# Altium schematic sheet Sensors.SchDoc: Sensors Signal Conditioners
size A3; Author: Eladio Delgado Mingorance; CompanyName: bq - Mundo Reader; Organization: bq - Mundo Reader; Revision: 1.4; SheetNumber: 3; SheetTotal: 10
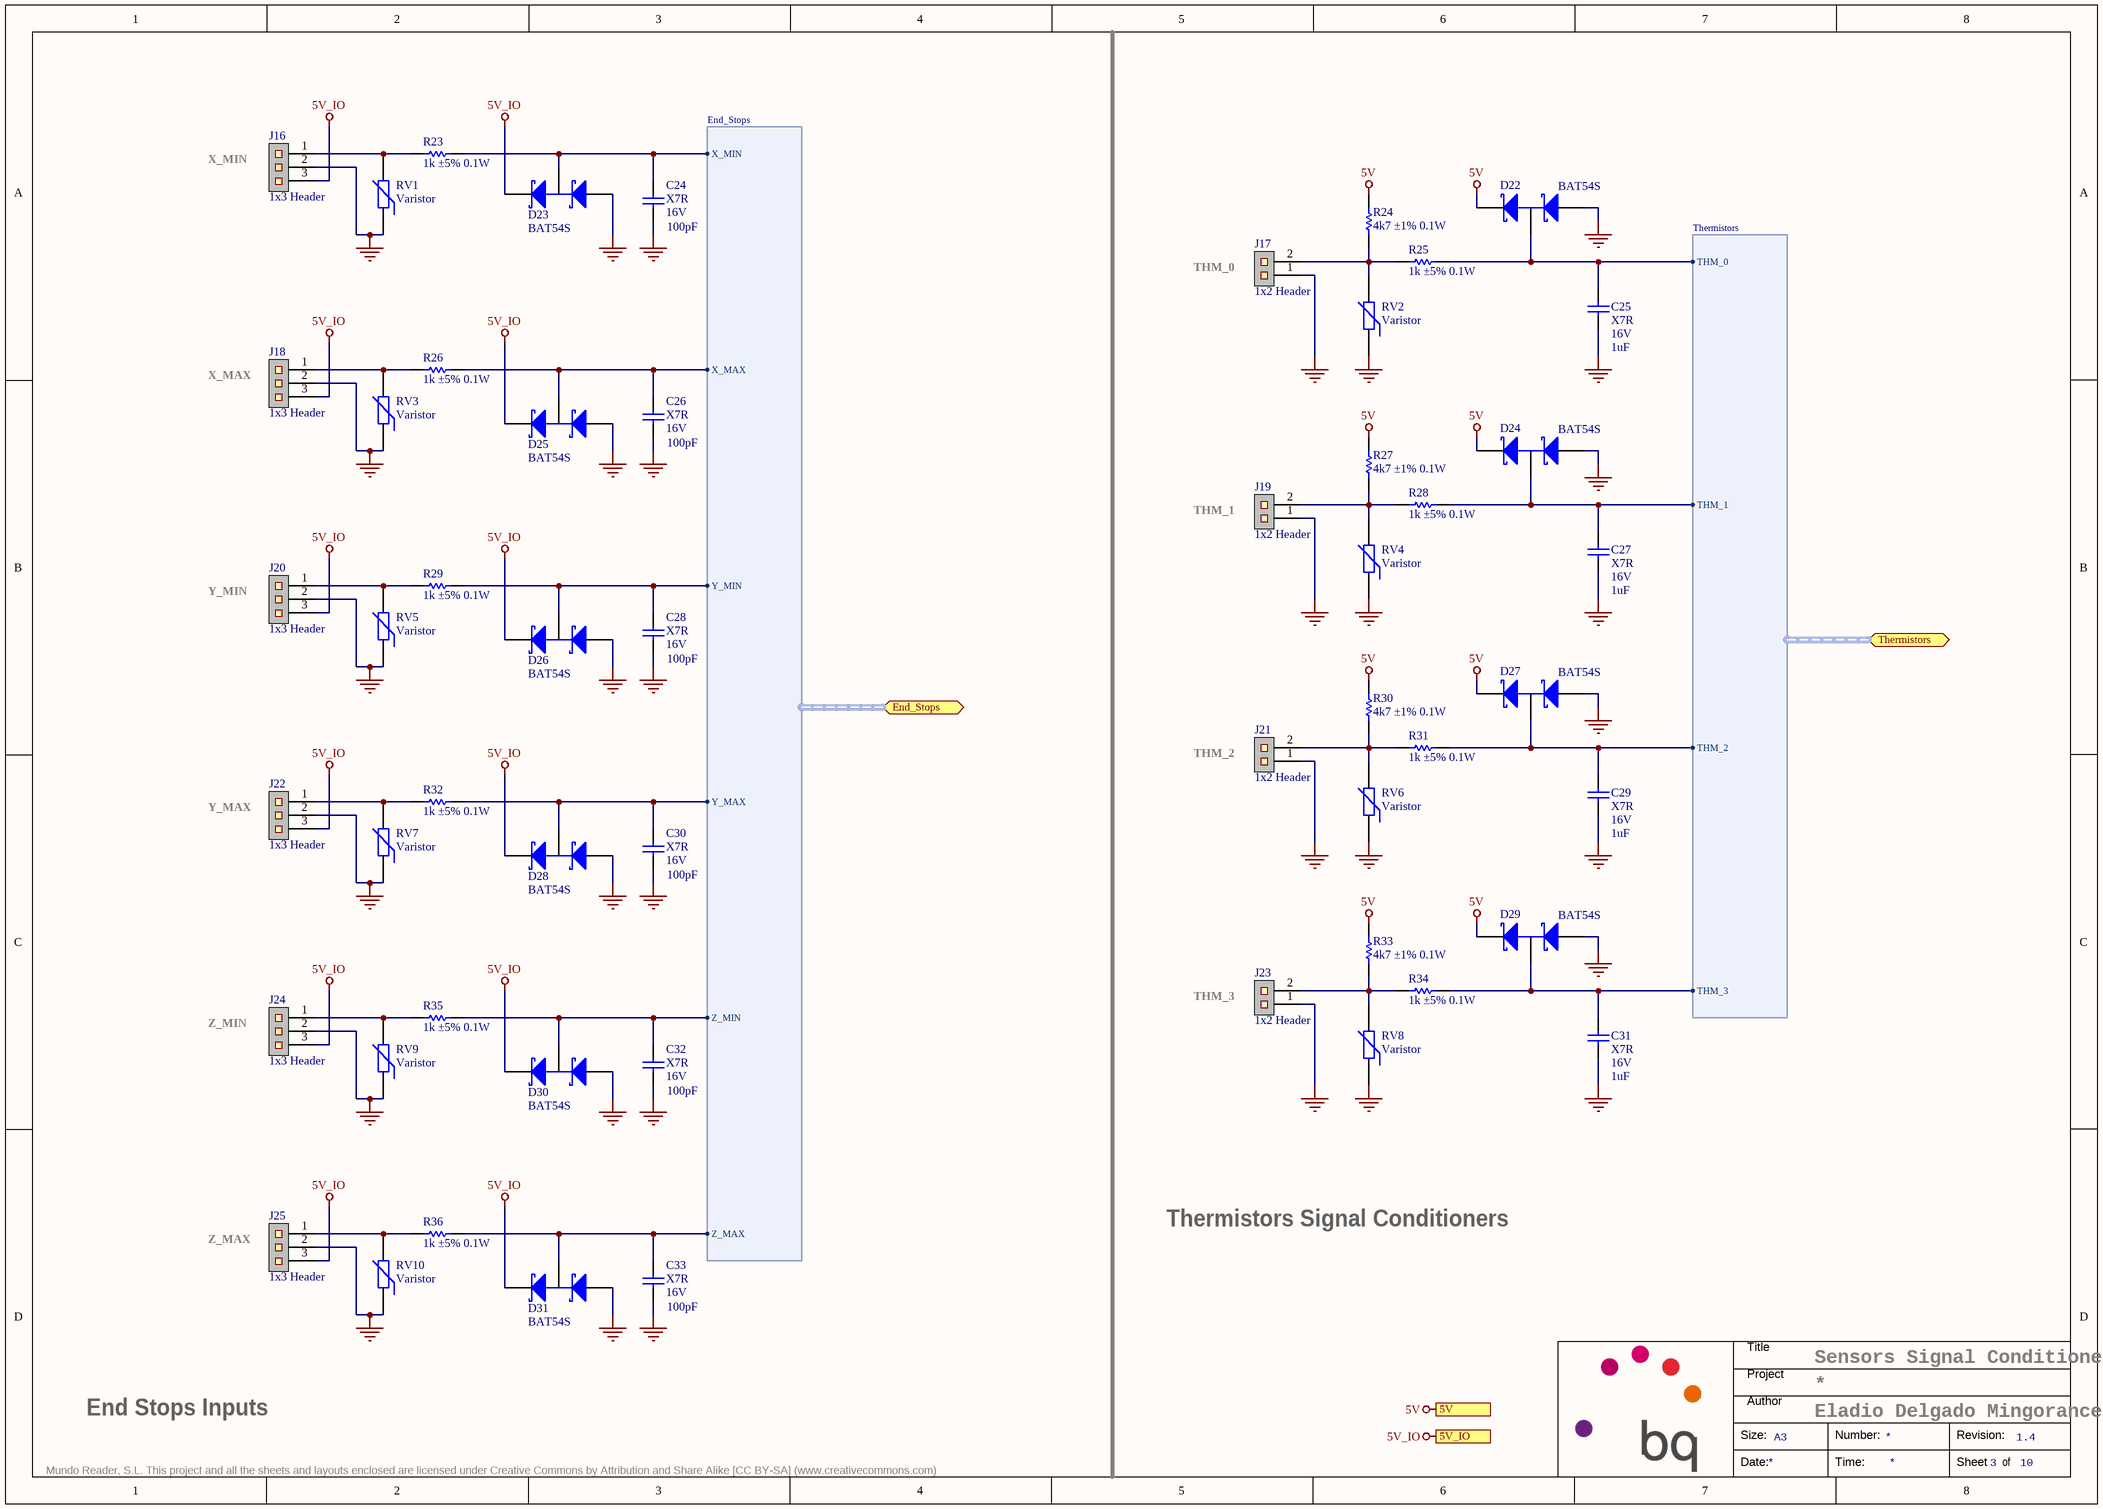
[diagram p0: Sensors.SchDoc]

## Parts
C24  Dielectric: X7R  Voltage: 16V  Capacitance: 100pF  [C0603]  (hidden comment: Capacitor)
C25  Dielectric: X7R  Voltage: 16V  Capacitance: 1uF  [C0603]  (hidden comment: Capacitor)
C26  Dielectric: X7R  Voltage: 16V  Capacitance: 100pF  [C0603]  (hidden comment: Capacitor)
C27  Dielectric: X7R  Voltage: 16V  Capacitance: 1uF  [C0603]  (hidden comment: Capacitor)
C28  Dielectric: X7R  Voltage: 16V  Capacitance: 100pF  [C0603]  (hidden comment: Capacitor)
C29  Dielectric: X7R  Voltage: 16V  Capacitance: 1uF  [C0603]  (hidden comment: Capacitor)
C30  Dielectric: X7R  Voltage: 16V  Capacitance: 100pF  [C0603]  (hidden comment: Capacitor)
C31  Dielectric: X7R  Voltage: 16V  Capacitance: 1uF  [C0603]  (hidden comment: Capacitor)
C32  Dielectric: X7R  Voltage: 16V  Capacitance: 100pF  [C0603]  (hidden comment: Capacitor)
C33  Dielectric: X7R  Voltage: 16V  Capacitance: 100pF  [C0603]  (hidden comment: Capacitor)
D22  BAT54S  [SOT23-3]
D23  BAT54S  [SOT23-3]
D24  BAT54S  [SOT23-3]
D25  BAT54S  [SOT23-3]
D26  BAT54S  [SOT23-3]
D27  BAT54S  [SOT23-3]
D28  BAT54S  [SOT23-3]
D29  BAT54S  [SOT23-3]
D30  BAT54S  [SOT23-3]
D31  BAT54S  [SOT23-3]
J16  1x3 Header  [1x3 MTE Straight Header 2.54mm]
J17  1x2 Header  [1x2 MTE Straight Header 2.54mm]
J18  1x3 Header  [1x3 MTE Straight Header 2.54mm]
J19  1x2 Header  [1x2 MTE Straight Header 2.54mm]
J20  1x3 Header  [1x3 MTE Straight Header 2.54mm]
J21  1x2 Header  [1x2 MTE Straight Header 2.54mm]
J22  1x3 Header  [1x3 MTE Straight Header 2.54mm]
J23  1x2 Header  [1x2 MTE Straight Header 2.54mm]
J24  1x3 Header  [1x3 MTE Straight Header 2.54mm]
J25  1x3 Header  [1x3 MTE Straight Header 2.54mm]
R23  value 1k ±5% 0.1W  [R0603]  (hidden comment: Resistor)
R24  value 4k7 ±1% 0.1W  [R0603]  (hidden comment: Resistor)
R25  value 1k ±5% 0.1W  [R0603]  (hidden comment: Resistor)
R26  value 1k ±5% 0.1W  [R0603]  (hidden comment: Resistor)
R27  value 4k7 ±1% 0.1W  [R0603]  (hidden comment: Resistor)
R28  value 1k ±5% 0.1W  [R0603]  (hidden comment: Resistor)
R29  value 1k ±5% 0.1W  [R0603]  (hidden comment: Resistor)
R30  value 4k7 ±1% 0.1W  [R0603]  (hidden comment: Resistor)
R31  value 1k ±5% 0.1W  [R0603]  (hidden comment: Resistor)
R32  value 1k ±5% 0.1W  [R0603]  (hidden comment: Resistor)
R33  value 4k7 ±1% 0.1W  [R0603]  (hidden comment: Resistor)
R34  value 1k ±5% 0.1W  [R0603]  (hidden comment: Resistor)
R35  value 1k ±5% 0.1W  [R0603]  (hidden comment: Resistor)
R36  value 1k ±5% 0.1W  [R0603]  (hidden comment: Resistor)
RV1  Varistor  [RV0603]
RV2  Varistor  [RV0603]
RV3  Varistor  [RV0603]
RV4  Varistor  [RV0603]
RV5  Varistor  [RV0603]
RV6  Varistor  [RV0603]
RV7  Varistor  [RV0603]
RV8  Varistor  [RV0603]
RV9  Varistor  [RV0603]
RV10  Varistor  [RV0603]

## Ports
5V, 5V_IO, End_Stops (harness End_Stops), Thermistors (harness Thermistors)

## Harnesses
End_Stops: X_MIN, X_MAX, Y_MAX, Z_MAX, Y_MIN, Z_MIN
Thermistors: THM_0, THM_1, THM_2, THM_3

## Nets
5V: D22.2(K) D24.2(K) D27.2(K) D29.2(K) R24.2 R27.2 R30.2 R33.2 ; port 5V
5V_IO: D23.2(K) D25.2(K) D26.2(K) D28.2(K) D30.2(K) D31.2(K) J16.3 J18.3 J20.3 J22.3 J24.3 J25.3 ; port 5V_IO
GND: C24.1 C25.1 C26.1 C27.1 C28.1 C29.1 C30.1 C31.1 C32.1 C33.1 D22.1(A) D23.1(A) D24.1(A) D25.1(A) D26.1(A) D27.1(A) D28.1(A) D29.1(A) D30.1(A) D31.1(A) J16.2 J17.1 J18.2 J19.1 J20.2 J21.1 J22.2 J23.1 J24.2 J25.2 RV1.1 RV2.1 RV3.1 RV4.1 RV5.1 RV6.1 RV7.1 RV8.1 RV9.1 RV10.1
NetC24_2: C24.2 D23.3(K) R23.2 ; port End_Stops.X_MIN
NetC25_2: C25.2 D22.3(K) R25.2 ; port Thermistors.THM_0
NetC26_2: C26.2 D25.3(K) R26.2 ; port End_Stops.X_MAX
NetC27_2: C27.2 D24.3(K) R28.2 ; port Thermistors.THM_1
NetC28_2: C28.2 D26.3(K) R29.2 ; port End_Stops.Y_MIN
NetC29_2: C29.2 D27.3(K) R31.2 ; port Thermistors.THM_2
NetC30_2: C30.2 D28.3(K) R32.2 ; port End_Stops.Y_MAX
NetC31_2: C31.2 D29.3(K) R34.2 ; port Thermistors.THM_3
NetC32_2: C32.2 D30.3(K) R35.2 ; port End_Stops.Z_MIN
NetC33_2: C33.2 D31.3(K) R36.2 ; port End_Stops.Z_MAX
NetJ16_1: J16.1 R23.1 RV1.2
NetJ17_2: J17.2 R24.1 R25.1 RV2.2
NetJ18_1: J18.1 R26.1 RV3.2
NetJ19_2: J19.2 R27.1 R28.1 RV4.2
NetJ20_1: J20.1 R29.1 RV5.2
NetJ21_2: J21.2 R30.1 R31.1 RV6.2
NetJ22_1: J22.1 R32.1 RV7.2
NetJ23_2: J23.2 R33.1 R34.1 RV8.2
NetJ24_1: J24.1 R35.1 RV9.2
NetJ25_1: J25.1 R36.1 RV10.2

## Notes on the sheet
- (near J16) X_MIN
- (near J17) THM_0
- (near J18) X_MAX
- (near J19) THM_1
- (near J20) Y_MIN
- (near J21) THM_2
- (near J22) Y_MAX
- (near J24) Z_MIN
- (near J23) THM_3
- (near J25) Z_MAX
- Thermistors Signal Conditioners
- End Stops Inputs
- Title
- Project
- Size:
- Author
- A3
- Number:
- Revision:
- Mundo Reader, S.L. This project and all the sheets and layouts enclosed are licensed under Creative Commons by Attribution and Share Alike [CC BY-SA] (www.creativecommons.com)
- Date:
- Time:
- Sheet
- of

## Library data of the parts
C24 C26 C28 C30 C32 C33 = C0603_100pF_16V_±10%: Manufacturer: Kemet; Value: 100pF ±10% 16V; Tolerance: ±10%; OrderingCode: C0603C101K4RAC; Temp_ Max: 125; Temp_ Min: -55; Part Number: C0603_100pF_16V_±10%; Price (€): 0,007
C25 C27 C29 C31 = C0603_1uF_16V_±10%_X7R: Manufacturer: TDK; Value: 1uF ±10% 16V; Tolerance: ±10%; OrderingCode: C1608X7R1C105K080AC; Temp_ Max: 125; Temp_ Min: -55; OrderingCode 2: C0603C105K4RACTU; Part Number: C0603_1uF_16V_±10%_X7R; Price (€): 0,018; Manufacturer 2: Kemet
D22-D31 = BAT54S: Dual Schottky Diode; Manufacturer: NXP; Ifor: 200mA; Vrrm: 30V; Ifsm: 600mA; Vf: 0,8V; Temp_ Max: 150; Temp_ Min: -55; Value: 200mA 30V; Part Number: BAT54S; OrderingCode: BAT54S; Supplier: Silica; Price (€): 0,037; Manufacturer 2: Vishay; OrderingCode 2: BAT54S
J16 J18 J20 J22 J24 J25 = CON_MTE_HDR_THT2.54_3: 1x3 MTE Straight Header 2.54mm; Manufacturer: TE Connectivity; OrderingCode: 5-104362-2; Temp_ Max: 105; Temp_ Min: -65; Value: 3; Part Number: CON_MTE_HDR_THT2.54_3; Price (€): 0,438; Supplier: Abacus
J17 J19 J21 J23 = CON_MTE_HDR_THT2.54_2: 1x2 MTE Straight Header 2.54mm; Manufacturer: TE Connectivity; OrderingCode: 5-104362-1; Temp_ Max: 105; Temp_ Min: -65; Value: 2; Part Number: CON_MTE_HDR_THT2.54_2; Price (€): 0,382; Supplier: Abacus
R23 R25 R26 R28 R29 R31 R32 R34-R36 = R0603_1k_0.1W_±5%: Manufacturer: Vishay; Tolerance: ±5%; OrderingCode: CRCW06031K00JN; Power: 0.1W; Resistance: 1k; Temp_ Max: 155; Temp_ Min: -55; PackageDescription: SMD; Part Number: R0603_1k_0.1W_±5%; Price (€): 0,003
R24 R27 R30 R33 = R0603_4k7_0.1W_±1%: Manufacturer: Vishay; Tolerance: ±1%; OrderingCode: CRCW06034K70FK; Power: 0.1W; Resistance: 4k7; Temp_ Max: 155; Temp_ Min: -55; PackageDescription: SMD; Part Number: R0603_4k7_0.1W_±1%; Price (€): 0,014
RV1-RV10 = Varistor 14V SMD: Manufacturer: Cooper Bussmann; Voltage: 14; Energy: 0,1J; OrderingCode: MLVA06V14C150; Temp_ Max: 85; Temp_ Min: -40; Part Number: Varistor 14V SMD; Price (€): 0,098